# Altium project PCB_AUTO-PUMP.PrjPcb
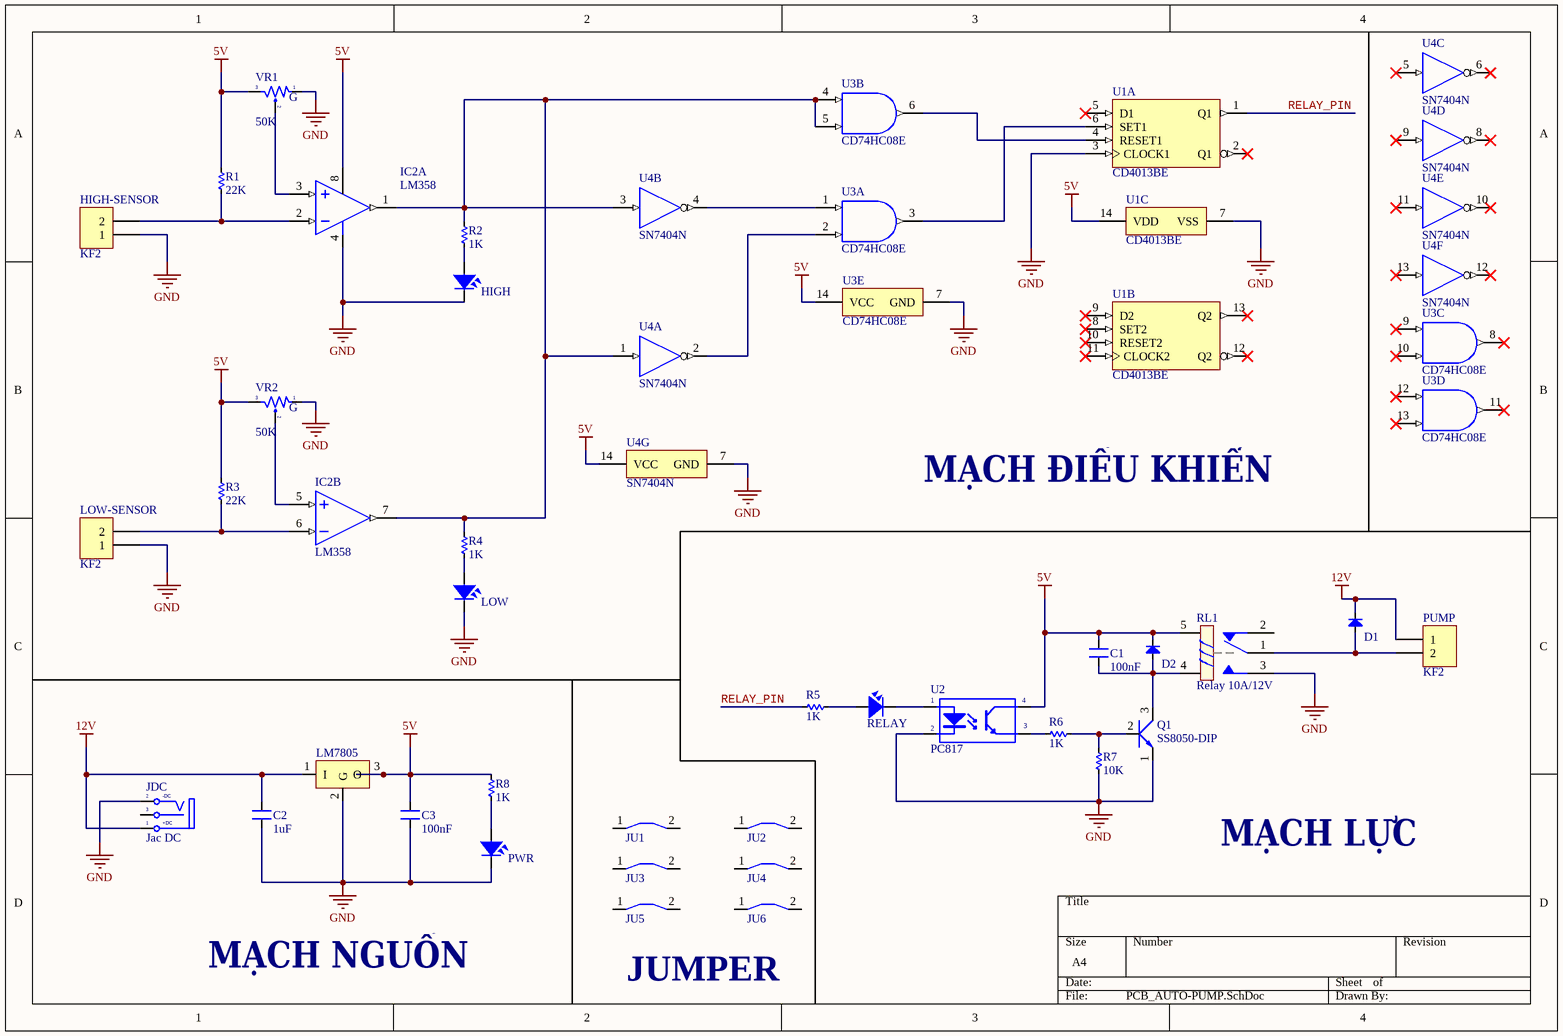
[diagram p0: PCB_AUTO-PUMP.SchDoc]
1 sheet, 37 parts. Net scope: global (net labels, ports and power ports of the same name join across sheets).
Board file: PCB_AUTO-PUMP.PcbDoc

## Sheet PCB_AUTO-PUMP.SchDoc
size A4

### Parts
C1  100nF  [CN1.5]
C2  1uF  [CN1.5]
C3  100nF  [CN1.5]
D1  1N4007  [DIO-1A]  (value not drawn)
D2  1N4007  [DIO-1A]  (value not drawn)
HIGH  LED  [LED-5-Green]  (value not drawn)
HIGH-SENSOR  KF2  [KF2-5.08]
IC2  LM358  [DIP8]  (parts A,B of 2)
JDC  Jac DC  [DC0]
JU1  JUMPER  [JUMPER 15MM]  (value not drawn)
JU2  JUMPER  [JUMPER 10MM]  (value not drawn)
JU3  JUMPER  [JUMPER 10MM]  (value not drawn)
JU4  JUMPER  [JUMPER 5MM]  (value not drawn)
JU5  JUMPER  [JUMPER 5MM]  (value not drawn)
JU6  JUMPER  [JUMPER 10MM]  (value not drawn)
LM7805  LM78xx  [TO220H1]  (value not drawn)
LOW  LED  [LED-5-Green]  (value not drawn)
LOW-SENSOR  KF2  [KF2-5.08]
PUMP  KF2  [KF2-5.08]
PWR  LED  [LED-5-Green]  (value not drawn)
Q1  SS8050-DIP  [SS8050DIP]
R1  22K  [RES-1/4W]
R2  1K  [RES-1/4W]
R3  22K  [RES-1/4W]
R4  1K  [RES-1/4W]
R5  1K  [RES-1/4W]
R6  1K  [RES-1/4W]
R7  10K  [RES-1/4W]
R8  1K  [RES-1/4W]
RELAY  LED  [LED-5-Green]  (value not drawn)
RL1  Relay 10A/12V  [RELAY 5]
U1  CD4013BE  [N0014A]  (parts A,B,C of 3)
U2  PC817  [DIP4]
U3  CD74HC08E  [N0014A]  (parts A,B,C,D,E of 5)
U4  SN7404N  [N0014A]  (parts A,B,C,D,E,F,G of 7)
VR1  50K  [VR-S2]
VR2  50K  [VR-S2]

### Nets
5V: C1.1 C3.2 D2.2(K) IC2.8(+V) LM7805.3(O) R1.1 R3.1 R8.2 RL1.5 U1.14(VDD) U2.4(C) U3.14(VCC) U4.14(VCC) VR1.3 VR2.3
12V: C2.2 D1.2(K) JDC.1(T) LM7805.1(I) PUMP.1
GND: C2.1 C3.1 HIGH.2 HIGH-SENSOR.1 IC2.4(-V) JDC.2(TN) LM7805.2(G) LOW.2 LOW-SENSOR.1 PWR.2 Q1.1(E) R7.1 RL1.3 U1.3(CLOCK1) U1.7(VSS) U2.2(K) U3.7(GND) U4.7(GND) VR1.1 VR2.1
RELAY_PIN: R5.1 U1.1(Q1)
NetC1_2: C1.2 D2.1(A) Q1.3(C) RL1.4
NetD1_1: D1.1(A) PUMP.2 RL1.1
NetHIGH-SENSOR_2: HIGH-SENSOR.2 IC2.2(IN-) R1.2
NetHIGH_1: HIGH.1 R2.1
NetIC2_1: IC2.1(OUT) IC2.7(OUT) R2.2 R4.2 U3.4(2A) U3.5(2B) U4.1(1A) U4.3(2A)
NetIC2_3: IC2.3(IN+) VR1.2
NetIC2_5: IC2.5(IN+) VR2.2
NetIC2_6: IC2.6(IN-) LOW-SENSOR.2 R3.2
NetLOW_1: LOW.1 R4.1
NetPWR_1: PWR.1 R8.1
NetQ1_2: Q1.2(B) R6.2 R7.2
NetR5_2: R5.2 RELAY.1
NetR6_1: R6.1 U2.3(E)
NetRELAY_2: RELAY.2 U2.1(A)
NetU1_4: U1.4(RESET1) U3.6(2Y)
NetU1_6: U1.6(SET1) U3.3(1Y)
NetU3_1: U3.1(1A) U4.4(~{2Y})
NetU3_2: U3.2(1B) U4.2(~{1Y})

Not connected (* = marked no-connect by the designer): JDC 3(S); JU1 1 2; JU2 1 2; JU3 1 2; JU4 1 2; JU5 1 2; JU6 1 2; RL1 2; U1 2(Q1)* 5(D1)* 8(SET2)* 9(D2)* 10(RESET2)* 11(CLOCK2)* 12(Q2)* 13(Q2)*; U3 8(3Y)* 9(3A)* 10(3B)* 11(4Y)* 12(4A)* 13(4B)*; U4 5(3A)* 6(~{3Y})* 8(~{4Y})* 9(4A)* 10(~{5Y})* 11(5A)* 12(~{6Y})* 13(6A)*

### Notes on the sheet
- MẠCH ĐIỀU KHIỂN
- MẠCH LỰC
- MẠCH NGUỒN
- JUMPER
- (in symbol DCIN) -DC; +DC
- (in symbol VR-S) G

### Library data of the parts
C1-C3 = CN: Value: 33pF
D1 D2 = Diode: Default Diode; Code - JEDEC: DO-214-AB; Value: 1N5007; Published: 8-Jun-2000; Revision: July-2002: Re-released for DXP Platform.; Publisher: Altium Limited
HIGH LOW PWR RELAY = LED: LED Single colour Green and Red; Value: LED 3 ly Single Colour
HIGH-SENSOR LOW-SENSOR PUMP = KF2: Manufacturer: Würth Elektronik eiSos GmbH; partNo: 691103110002; ComponentLink1 Description: Manufacturer; ComponentLink2 Description: Datasheet; NoPins: 2; Created Date: 29 October 2013; ComponentLink1URL: http://www.we-online.com; ComponentLink2URL: http://katalog.we-online.de/em/datasheet/6911031100xx.pdf; Created by: Karrer Zheng
IC2 = LM358: Low-Power Dual Operational Amplifier; Value: LM358
JDC = DCIN: Jac DC input; Value: Jac DC
LM7805 = LM78xx: Positive Voltage Regulator; Note: Tab is connected to pin 3 (GND).; Published: 24-Aug-2001; LatestRevisionDate: 17-Jul-2002; LatestRevisionNote: Re-released for DXP Platform.; DatasheetVersion: Apr-1994; PackageVersion: Jul-1998; PackageReference: ISOWATT220AB; Publisher: Altium Limited; PackageDescription: TO, Thru-Hole, Vertical, Heatsink Mounted; 3 In-Line Leads; Pitch 2.54 mm; Pin sequence 1, 3, 2; ComponentLink1Description: Manufacturer Link; ComponentLink1URL: http://www.st.com/; ComponentLink2Description: Datasheet; ComponentLink2URL: http://www.st.com/stonline/products/literature/ds/2146/l78m05c.pdf
Q1 = SS8050-DIP: NPN transistor through hole
R1-R8 = Res: Manufacturer: Generic Components; Class: Passive; SubClass: R; Published: 08/06/2000; Publisher: Altium Hobart Technology Centre
RL1 = Relay 5: Relay SPDT,10A - 12VDC 5 Pin; Value: Relay SPDT, 10A, 12V
U1 = CMP-1619-00744-2: CMOS Dual D-Type Flip Flop, N0014A, TUBE; Manufacturer: Texas Instruments; Schmitt Trigger: No; F @ Nom Voltage(Max)(Mhz): 8; tpd @ Nom Voltage(Max)(ns): 130; Output Logic: Inverted,Non-inverted; Rating: Military; Technology Family: CD4000; Voltage(Nom)(V): 10; Bits(#): 2; Output Drive (IOL/IOH)(Max)(mA): 1.5/-1.5; VCC(Min)(V): 3; VCC(Max)(V): 18; ICC @ Nom Voltage(Max)(mA): 0.06; Generic Part Number: CD4013B; 3-State Output: No; DatasheetVersion: SCHS023D; Input Type: CMOS; Code_JEDEC: MS-001; Operating Temperature Range(C): -55 to 125; PackageReference: N0014A; Output Type: CMOS
U2 = PC817: Single Opto; Value: PC817
U3 = CMP-0777-00277-3: High Speed CMOS Logic Quad 2-Input AND Gates, N0014A, TUBE; Manufacturer: Texas Instruments; Bits(#): 4; Voltage(Nom)(V): 5; VCC(Max)(V): 6; Schmitt Trigger: No; tpd @ Nom Voltage(Max)(ns): 23; Rating: Catalog; VCC(Min)(V): 2; F @ Nom Voltage(Max)(Mhz): 70; Technology Family: HC; Output Drive (IOL/IOH)(Max)(mA): -24/24; ICC @ Nom Voltage(Max)(mA): 0.02; Operating Temperature Range(C): -55 to 125; PackageReference: N0014A; Input Type: CMOS; Generic Part Number: CD74HC08; Output Type: CMOS; DatasheetVersion: SCHS118C
U4 = CMP-1615-00872-2: Hex inverters, N0014A, TUBE; Generic Part Number: SN7404; Manufacturer: Texas Instruments; Voltage(Nom)(V): 5; Bits(#): 6; tpd @ Nom Voltage(Max)(ns): 22; Schmitt Trigger: No; VCC(Max)(V): 5.25; ICC @ Nom Voltage(Max)(mA): 0.033; Technology Family: TTL; Rating: Catalog; F @ Nom Voltage(Max)(Mhz): 35; Output Type: CMOS; VCC(Min)(V): 4.75; Output Drive (IOL/IOH)(Max)(mA): -0.4/16; DatasheetVersion: SDLS029C; Code_JEDEC: MS-001; Operating Temperature Range(C): 0 to 70; PackageReference: N0014A; Input Type: TTL
VR1 VR2 = VR-S: Var Resistor; Value: Volume 50k